# Altium schematic sheet POWERMANAGE2.SchDoc
size A3; SheetNumber: 11; SheetTotal: 14; SPICEModelCacheVRZJBZTH: <root> / <DocumentId>VRZJBZTH</DocumentId> / </root>
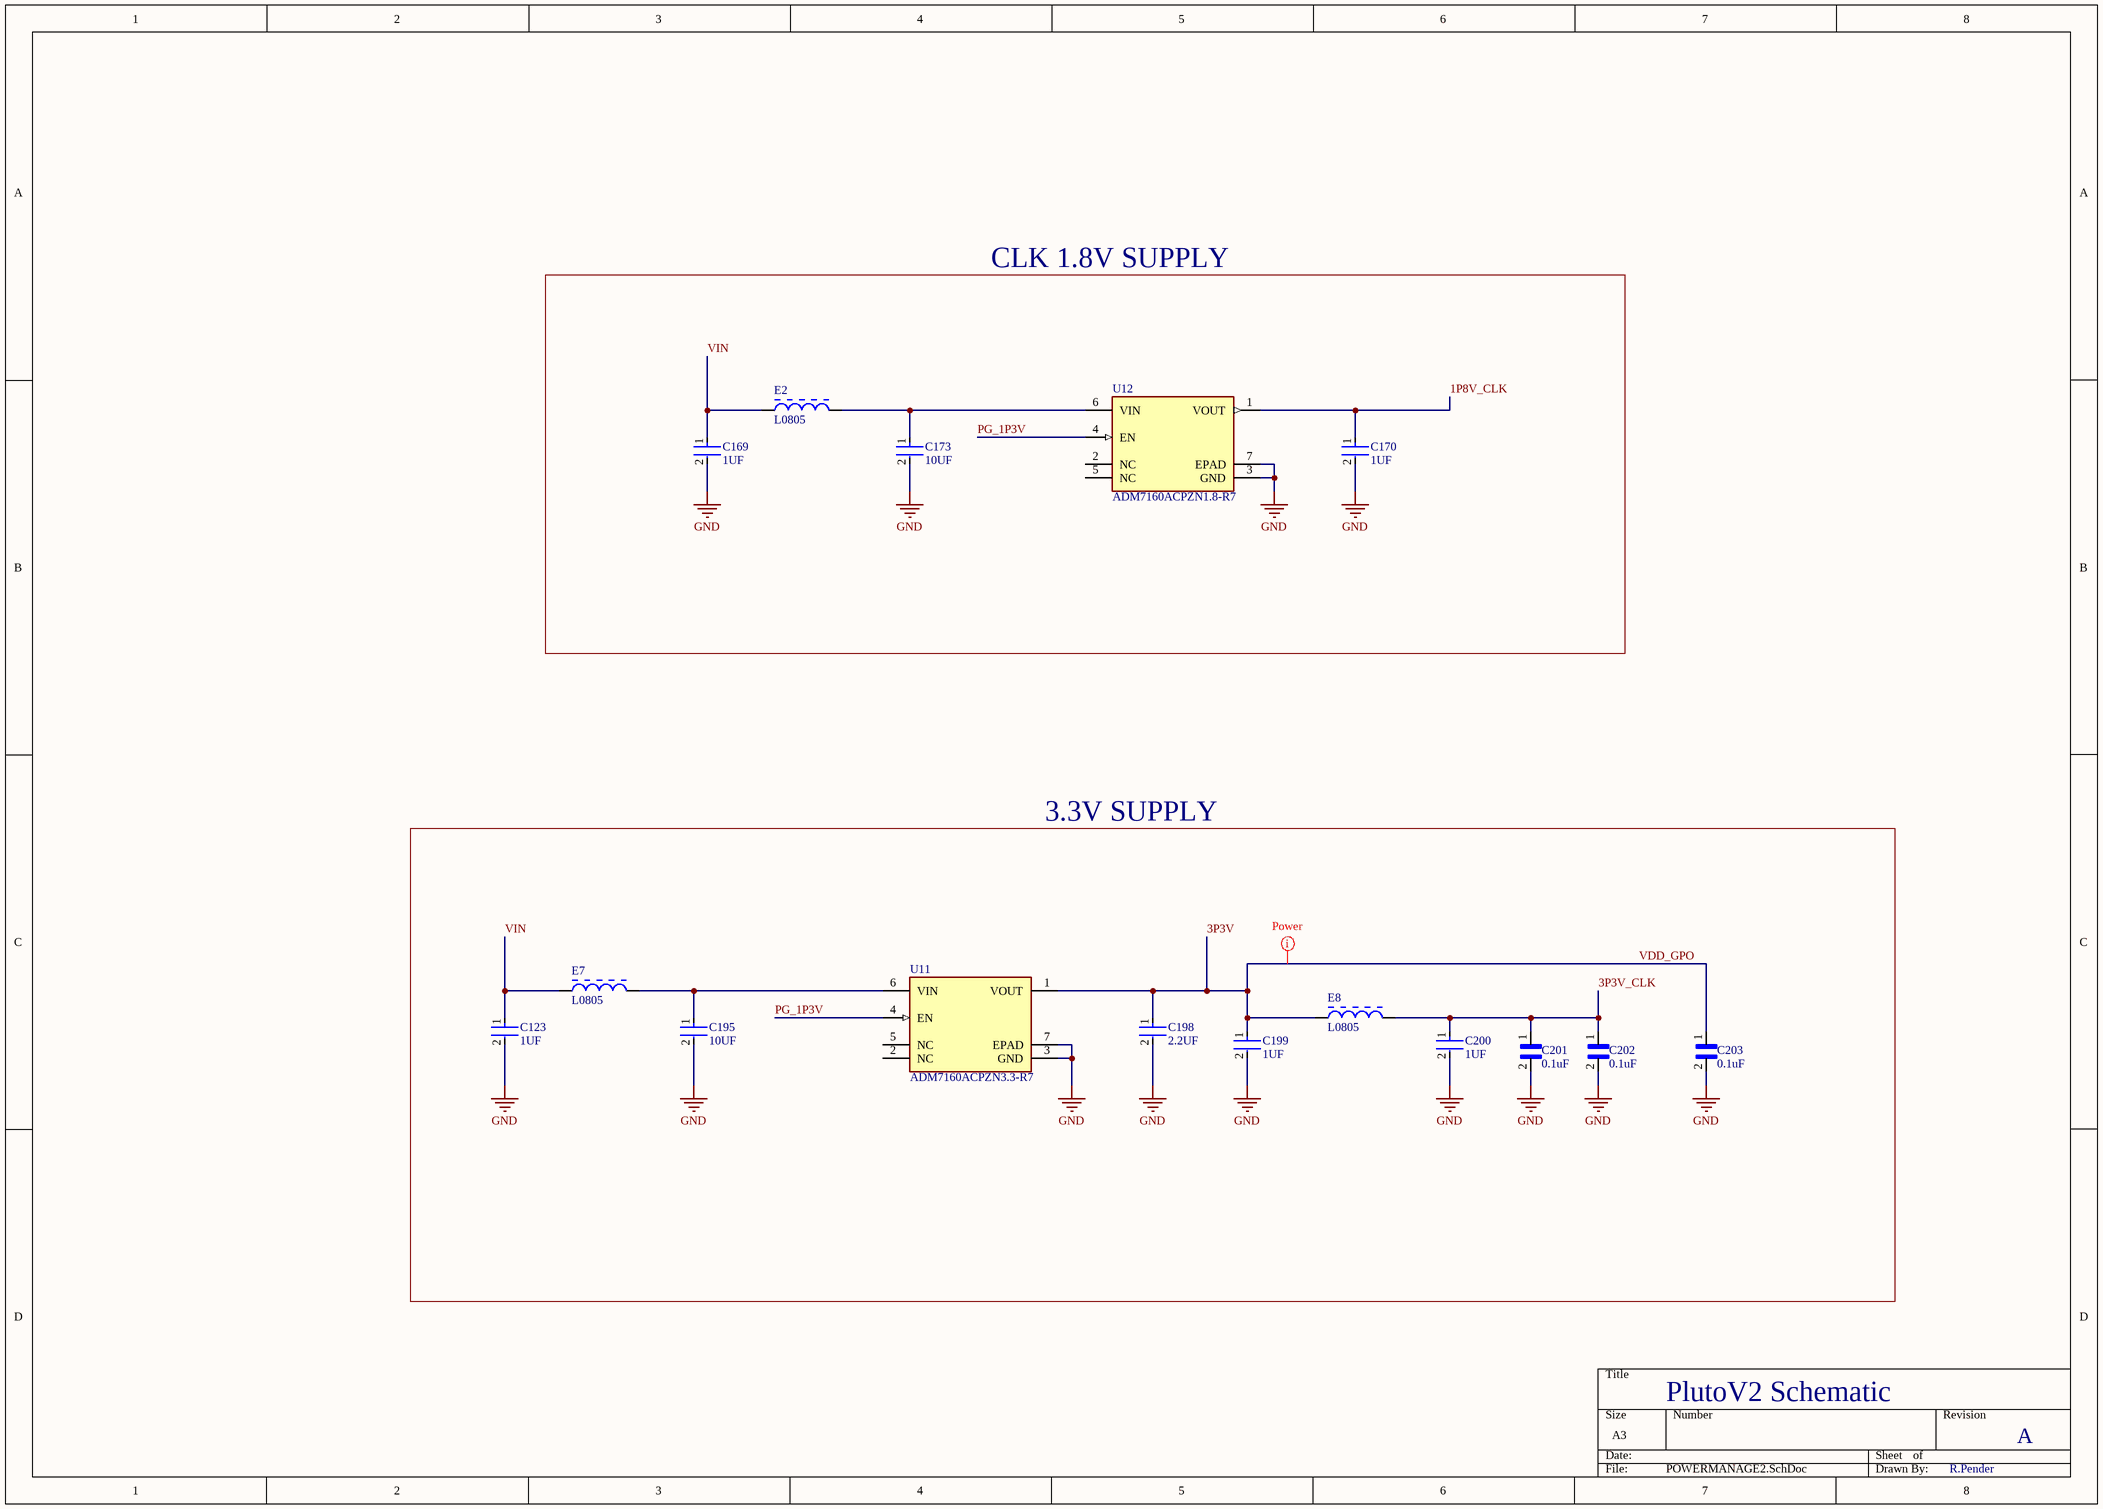
[diagram p0: POWERMANAGE2.SchDoc]

## Parts
C123  1UF  [FP-0402-L_1_0_0_05-W_0_5-IPC_A]
C169  1UF  [FP-0402-L_1_0_0_05-W_0_5-IPC_A]
C170  1UF  [FP-0402-L_1_0_0_05-W_0_5-IPC_A]
C173  10UF  [FP-GRM188-0_15-MFG]
C195  10UF  [FP-GRM188-0_15-MFG]
C198  2.2UF  [FP-GRM188-0_2-IPC_C]
C199  1UF  [FP-0402-L_1_0_0_05-W_0_5-IPC_A]
C200  1UF  [FP-0402-L_1_0_0_05-W_0_5-IPC_A]
C201  0.1uF  [CAPC0603X33N]
C202  0.1uF  [CAPC0603X33N]
C203  0.1uF  [CAPC0603X33N]
E2  L0805  [TDK-MPZ2012S101A-2_V]
E7  L0805  [TDK-MPZ2012S101A-2_V]
E8  L0805  [TDK-MPZ2012S101A-2_V]
U11  ADM7160ACPZN3.3-R7  [FP-CP-6-3-IPC_A]
U12  ADM7160ACPZN1.8-R7  [FP-CP-6-3-IPC_C]

## Blocks framed on the sheet
CLK 1.8V SUPPLY: C169 C170 C173 E2 U12
3.3V SUPPLY: C123 C195 C198-C203 E7 E8 U11

## Nets
GND: C123.2 C169.2 C170.2 C173.2 C195.2 C198.2 C199.2 C200.2 C201.2 C202.2 C203.2 U11.3(GND) U11.7(EPAD) U12.3(GND) U12.7(EPAD)
1P8V_CLK: C170.1 U12.1(VOUT)
3P3V: C198.1 C199.1 C203.1 E8.1 U11.1(VOUT)  [also labelled VDD_GPO]
3P3V_CLK: C200.1 C201.1 C202.1 E8.2
PG_1P3V: U11.4(EN) U12.4(EN)
VIN: C123.1 C169.1 E2.1 E7.1
NetC173_1: C173.1 E2.2 U12.6(VIN)
NetC195_1: C195.1 E7.2 U11.6(VIN)

Not connected (* = marked no-connect by the designer): U11 2(NC) 5(NC); U12 2(NC) 5(NC)

## Layout directives
net class Power: 3P3V

## Notes on the sheet
- PlutoV2 Schematic
- A
- R.Pender

## Library data of the parts
C123 C169 C170 C199 C200 = CMP-14477-000104-2: None; Tolerance: 10%; Voltage Rating: 16V; Dielectric: X5R; Packaging: Tape and Reel; Depth: 0.5mm; Mount: Surface Mount; Thickness: 0.022inch; Package Quantity: 1; Min Operating Temperature: -55°C; Series: M; Voltage Rating (DC): 16V; Termination: SMD/SMT; Case/Package: 0402; Number of Pins: 2; Case Code (Imperial): 0402; Capacitance: 1uF; Length: 1mm; Halogen Free: Halogen Free; Case Code (Metric): 1005; Width: 0.02inch; RoHS Compliant: Yes; Radiation Hardening: No; Max Operating Temperature: 85°C; Height: 0.5mm; Construction: Flat
C173 C195 = CMP-06035-003612-1: Chip Multilayer Ceramic Capacitors for General Purpose, 0603, 10uF, X5R, 15%, 20%, 10V; Tolerance: 20%; Dielectric: X5R; Package Quantity: 4000; Width: 0.8mm; Case/Package: 0603; Thickness: 0.035inch; Capacitance: 10uF; Voltage Rating: 10V; Voltage Rating (DC): 10V; Termination: SMD/SMT; Length: 1.6mm; Lead Free: Lead Free; Mount: Surface Mount; Height: 0.8mm; Depth: 0.8mm; Packaging: Tape and Reel; Weight: 0.000222oz; Min Operating Temperature: -55°C; Case Code (Metric): 1608; Max Operating Temperature: 85°C; Case Code (Imperial): 0603; Material: Ceramic
C198 = CMP-06035-023692-1: Chip Multilayer Ceramic Capacitors for General Purpose, 0603, 2.2uF, X5R, 15%, 10%, 50V; Mount: Surface Mount; Case/Package: 0603; Voltage Rating (DC): 50V; Weight: 0.000222oz; Capacitance: 2.2uF; Max Operating Temperature: 85°C; Length: 0.063inch; Thickness: 0.039inch; Dielectric: X5R; Min Operating Temperature: -55°C; Termination: SMD/SMT; Resistor Type: Ceramic; Width: 0.8mm; Voltage Rating: 50V; Height: 0.8mm; Tolerance: 10%; Case Code (Metric): 1608; Package Quantity: 10000; Packaging: Tape and Reel; Case Code (Imperial): 0603
C201-C203 = GRM033R61C104ME84D: CAP 0.1UF 16VDC X5R 20% SMD 0201 PAPER TAPE; Package: None; Price: None; Value: *; MP: GRM033R61C104ME84D; Availability: Unavailable
E2 E7 E8 = CMP-2000-05399-1: Chip Bead for Power Line, 100 Ohm, +/- 25%, 4 A, -55 to 125 degC, 0805 (2012 Metric), RoHS, Tape and Reel; Manufacturer: TDK; Maximum DC Resistance: 20mOhms; Test Frequency: 100MHz; Impedance: 100Ohms; Case Width: 1.25mm; Case Length: 2mm; Maximum DC Current: 4A; Case Height: 0.85mm; Package Reference: MPZ2012S101A-2; RoHS: Details; Tolerance: 25%; Operating Temperature Range: -55Cto+125C; Datasheet Version: Jul-13; Dimensions: 1.25mmWx2mmLx0.85mmH; Product: FerriteChipBeads; Termination Style: SMD/SMT; Datasheet URL: http://www.farnell.com/datasheets/1750041.pdf; Factory Pack Quantity: 4000; Brand: TDK; Packaging: Reel; Package Description: 2-Pin Surface Mount Device, Body 2 x 1.25 mm; Product Category: EMIFilterBeads,Chips&Arrays; Manufacturer URL: http://www.tdk.com/; Package / Case: 0805(2012metric)
U11 = CMP-09138-000129-1: IC REG LINEAR 3.3V 200MA 6LFCSP; Output Type: Fixed; Max Supply Current: 265uA; Max Input Voltage: 5.5V; Number of Regulators: 1; Power Supply Rejection Ratio (PSRR): 49dB; Operating Supply Current: 265mA; Polarity: Positive; Min Input Voltage: 2.2V; Dropout Voltage: 150mV; Accuracy: 1%; Min Current Limit: 220mA; Max Output Current: 200mA; RoHS Compliant: Yes; Case/Package: TSOT; Max Operating Temperature: 125°C; Contact Plating: Gold; Number of Pins: 6; Mount: Surface Mount; Packaging: Tape and Reel; Number of Outputs: 1; Lead Free: Contains Lead; Package Quantity: 3000; Min Operating Temperature: -40°C; Output Voltage: 3.3V; Output Current: 200mA; Quiescent Current: 265uA
U12 = CMP-09138-000112-1: IC REG LINEAR 1.8V 200MA 6LFCSP; Operating Supply Current: 265mA; Power Supply Rejection Ratio (PSRR): 49dB; Polarity: Positive; Max Supply Current: 265uA; Dropout Voltage: 230mV; Number of Outputs: 1; Min Current Limit: 220mA; Output Type: Fixed; Accuracy: 1%; Min Input Voltage: 2.2V; Max Input Voltage: 5.5V; Packaging: Tape and Reel; Case/Package: TSOT; Contact Plating: Gold; Mount: Surface Mount; Max Output Current: 200mA; Min Operating Temperature: -40°C; Output Voltage: 1.8V; Output Current: 200mA; Number of Pins: 6; Package Quantity: 3000; Lead Free: Contains Lead; Quiescent Current: 265uA; Max Operating Temperature: 125°C; Number of Regulators: 1; RoHS Compliant: Yes